# EAGLE design pc_max86150_breakout_qwiic2part_part2 (EAGLE 6.6.0)
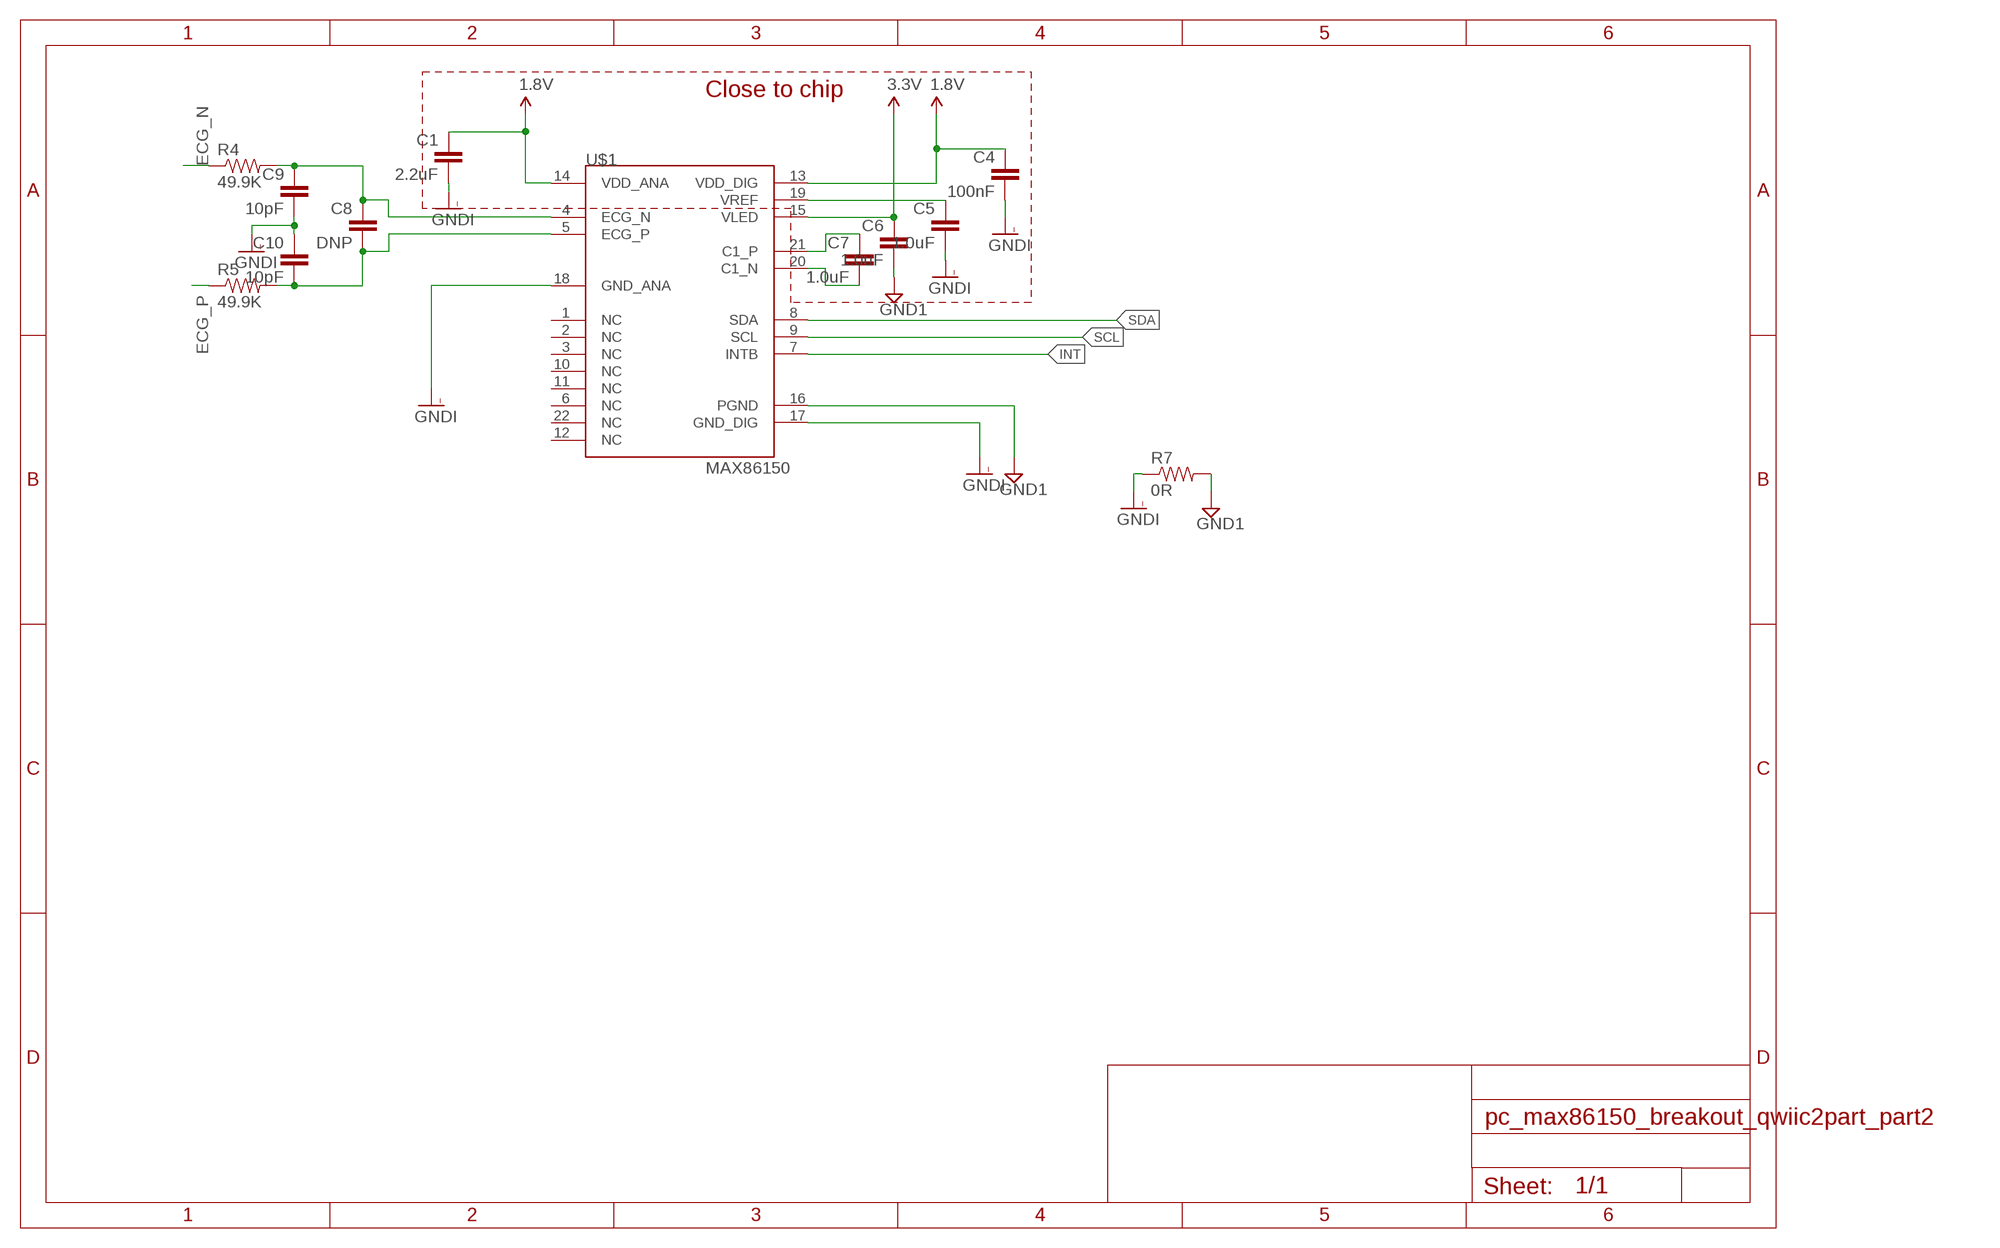
[diagram p0: schematic, sheet 1]

## Parts
C1  2.2uF  1.0UF-0402-16V-10%  [0402]
C4  100nF  1.0UF-0402-16V-10%  [0402]
C5  1.0uF  1.0UF-0402-16V-10%  [0402]
C6  1.0uF  1.0UF-0402-16V-10%  [0402]
C7  1.0uF  1.0UF-0402-16V-10%  [0402]
C8  DNP  1.0UF-0402-16V-10%  [0402]
C9  10pF  1.0UF-0402-16V-10%  [0402]
C10  10pF  1.0UF-0402-16V-10%  [0402]
R4  49.9K  RESISTOR0402-RES  [0402-RES]
R5  49.9K  RESISTOR0402-RES  [0402-RES]
R7  0R  RESISTOR0402-RES  [0402-RES]
U$1  MAX86150  [MAX86150]

## Nets
1.8V: C1.1 C4.1 U$1.13(VDD_DIG) U$1.14(VDD_ANA)
3.3V: C6.1 U$1.15(VLED)
ECG_N: R4.1
ECG_P: R5.1
GND1: C6.2 R7.2 U$1.16(PGND)
GNDI: C1.2 C4.2 C5.2 C9.2 C10.1 R7.1 U$1.17(GND_DIG) U$1.18(GND_ANA)
INT: U$1.7(INTB)
N$1: C7.1 U$1.21(C1_P)
N$2: C7.2 U$1.20(C1_N)
N$3: C8.1 C9.1 R4.2 U$1.4(ECG_N)
N$4: C5.1 U$1.19(VREF)
N$5: C8.2 C10.2 R5.2 U$1.5(ECG_P)
SCL: U$1.9(SCL)
SDA: U$1.8(SDA)
Unconnected: U$1.1(NC) U$1.2(NC) U$1.3(NC) U$1.6(NC) U$1.10(NC) U$1.11(NC) U$1.12(NC) U$1.22(NC)

## Notes on the sheet
- Close to chip

## Library data of the parts
C1 C4 C8-C10 = SparkFun-Capacitors:1.0UF: 1µF ceramic capacitors A capacitor is a passive two-terminal electrical component used to store electrical energy temporarily in an electric field.; PROD_ID: CAP-12417; VALUE: 1.0uF
C5-C7 = SparkFun-Capacitors:1.0UF: 1µF ceramic capacitors A capacitor is a passive two-terminal electrical component used to store electrical energy temporarily in an electric field.; PROD_ID: CAP-12417
R4 R5 R7 = SparkFun:RESISTOR: Resistor Basic schematic elements and footprints for 0603, 1206, and PTH resistors.
U$1 = circuitects:MAX86150

## Board
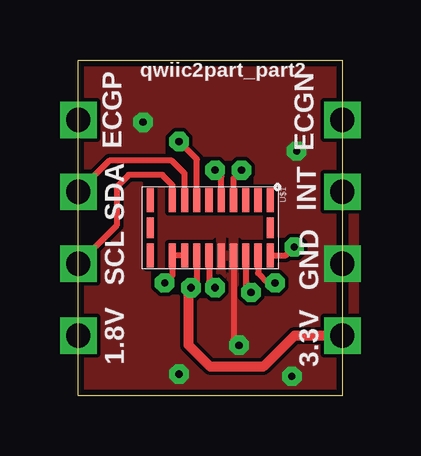
[diagram p1: board, top side]
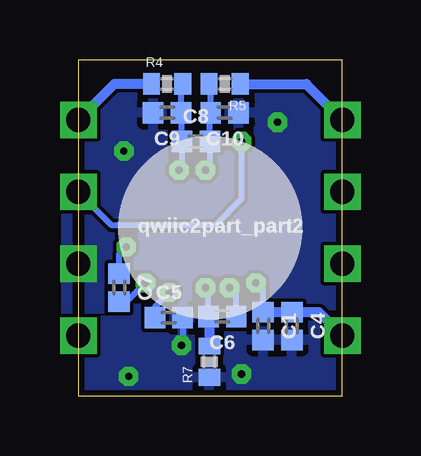
[diagram p2: board, bottom side, seen from below]

Size 11 x 14 mm. Coordinates in mm from the lower left corner, seen from the top.
Outline: 0,14 11,14 11,0 0,0 0,14
Copper layers (1*2*15*16): Top 0.035mm / dielectric 1.5mm / Route2 0.035mm / dielectric 0.15mm / Route15 0.035mm / dielectric 0.2mm / Bottom 0.035mm
Design rules "Circuitects-Rules": minimum track width 6mil, minimum drill 0.3mm, track to track 6mil, track to pad 6mil, pad to pad 6mil, via to via 6mil, smd to smd 6mil, copper to edge 10mil, drill to drill 8mil, minimum pad ring 12mil, minimum via ring 10mil, stop-mask expansion 4mil, vias tented up to drill 25mil, thermal gap 10mil

### Footprints (pad centres in the part's own frame; a part is rotated, then mirrored left to right if it is on the bottom)
0402 = smd 0.85 x 0.9: 1 -0.58,0; 2 0.58,0
0402-RES = smd 0.7 x 0.9: 1 -0.65,0; 2 0.65,0
MAX86150 = smd 1 x 0.3: 1 -1.15,2.5; 2 -1.15,1.99; 3 -1.15,1.48; 4 -1.15,0.97; 5 -1.15,0.46; 6 -1.15,-0.05; 7 -1.15,-0.56; 8 -1.15,-1.07; 9 -1.15,-1.58; 10 -1.15,-2.5; 12 1.15,-2.5; 13 1.15,-1.58; 14 1.15,-1.07; 15 1.15,-0.56; 16 1.15,-0.05; 17 1.15,0.46; 18 1.15,0.97; 19 1.15,1.48; 20 1.15,1.99; 21 1.15,2.5 | smd 0.85 x 0.3: 11 0,-2.5; 22 0,2.5

### Placement (x,y rotation side)
C1  3.3,2.9 270 bottom
C4  2.1,2.9 270 bottom
C5  7.23,3.25 0 bottom
C6  5,3.3 180 bottom
C7  9.3,4.5 270 bottom
C8  6.1,10.6 0 bottom
C9  7.3,11.8 180 bottom
C10  4.9,11.8 180 bottom
R4  7.3,13 0 bottom
R5  4.9,13 180 bottom
R7  5.54,1.41 90 bottom
U$1  5.5,7 270 top

### Tracks (layer width: path | path; a pad name or v marks a point on that pad's centre or on a via)
1.8V  (via drill 0.3, 1.02)
  Top 0.254: U$1.14 U$1.13 3.92,5.02 v3.6,4.7
  Bottom 0.254: C1.1 3.3,4.4 v3.6,4.7
  Bottom 0.406: v0,2.5 0.98,3.48 C4.1 C1.1
3.3V  (via drill 0.3, 1.02)
  Top 0.254: U$1.15 4.94,4.74 v4.7,4.5
  Top 0.406: v11,2.5 9,2.5 7.7,1.2 5.5,1.2 4.6,2.1 4.6,4.4 v4.7,4.5
  Bottom 0.254: C6.1 4.42,4.22 v4.7,4.5
ECG_N  (via drill 1.02)
  Bottom 0.406: R4.1 9.5,13 v11,11.5
ECG_P  (via drill 1.02)
  Bottom 0.406: R5.1 1.5,13 v0,11.5
GND1  (via drill 0.3)
  Top 0.254: U$1.16 5.45,4.75 v5.7,4.5
  Bottom 0.254: C6.2 5.58,4.38 v5.7,4.5
  Bottom 0.406: C6.2 5.54,3.3 R7.2
GNDI  (via drill 0.3, 1.02)
  Top 0.254: U$1.18 6.47,2.33 v6.7,2.1
  Bottom 0.254: C5.2 6.65,2.15 v6.7,2.1
  other vias: 11,5.5 2.7,11.4 9.1,10.2 4.2,0.9 8.9,0.8
  pour Bottom: -0.5,-0.5 11.5,-0.5 11.5,14.5 -0.5,14.5
  pour Top: -0.5,-0.5 11.5,-0.5 11.5,14.5 -0.5,14.5
INT  (via drill 0.3, 1.02)
  Top 0.254: U$1.7 4.94,9.86 v4.2,10.6
  Bottom 0.254: v4.2,10.6 4.2,8.2 5.3,7.1 9.6,7.1 v11,8.5
N$1  (via drill 0.3)
  Top 0.254: U$1.21 8.65,5.85 v9,6.2
  Bottom 0.254: C7.1 9.3,5.9 v9,6.2
N$2  (via drill 0.3)
  Top 0.254: U$1.20 7.49,5.11 7.9,4.7 v8.2,4.7
  Bottom 0.254: C7.2 8.98,3.92 v8.2,4.7
N$3  (via drill 0.3)
  Top 0.254: U$1.4 6.47,9.07 v6.8,9.4
  Bottom 0.254: v6.8,9.4 6.68,9.52 C8.1 6.68,11.76 C9.1 6.72,12.93 R4.2
N$4  (via drill 0.3)
  Top 0.254: U$1.19 6.98,4.52 v7.2,4.3
  Bottom 0.254: C5.1 7.81,3.69 v7.2,4.3
N$5  (via drill 0.3)
  Top 0.254: U$1.5 5.96,9.14 v5.7,9.4
  Bottom 0.254: v5.7,9.4 5.52,9.58 C8.2 5.52,11.76 C10.2 5.48,12.93 R5.2
SCL  (via drill 1.02)
  Top 0.254: U$1.9 3.92,8.78 3.5,9.2 2.1,9.2 1.6,8.7 1.6,7.1 v0,5.5
SDA  (via drill 1.02)
  Top 0.254: U$1.8 4.43,9.27 3.9,9.8 1.3,9.8 v0,8.5

### Text on the board
tPlace: qwiic2part_part2 | ECGP | ECGN | INT | SDA | SCL | GND | 1.8V | 3.3V
bPlace: qwiic2part_part2